# Altium project FlyController-H743-v2.PrjPcb
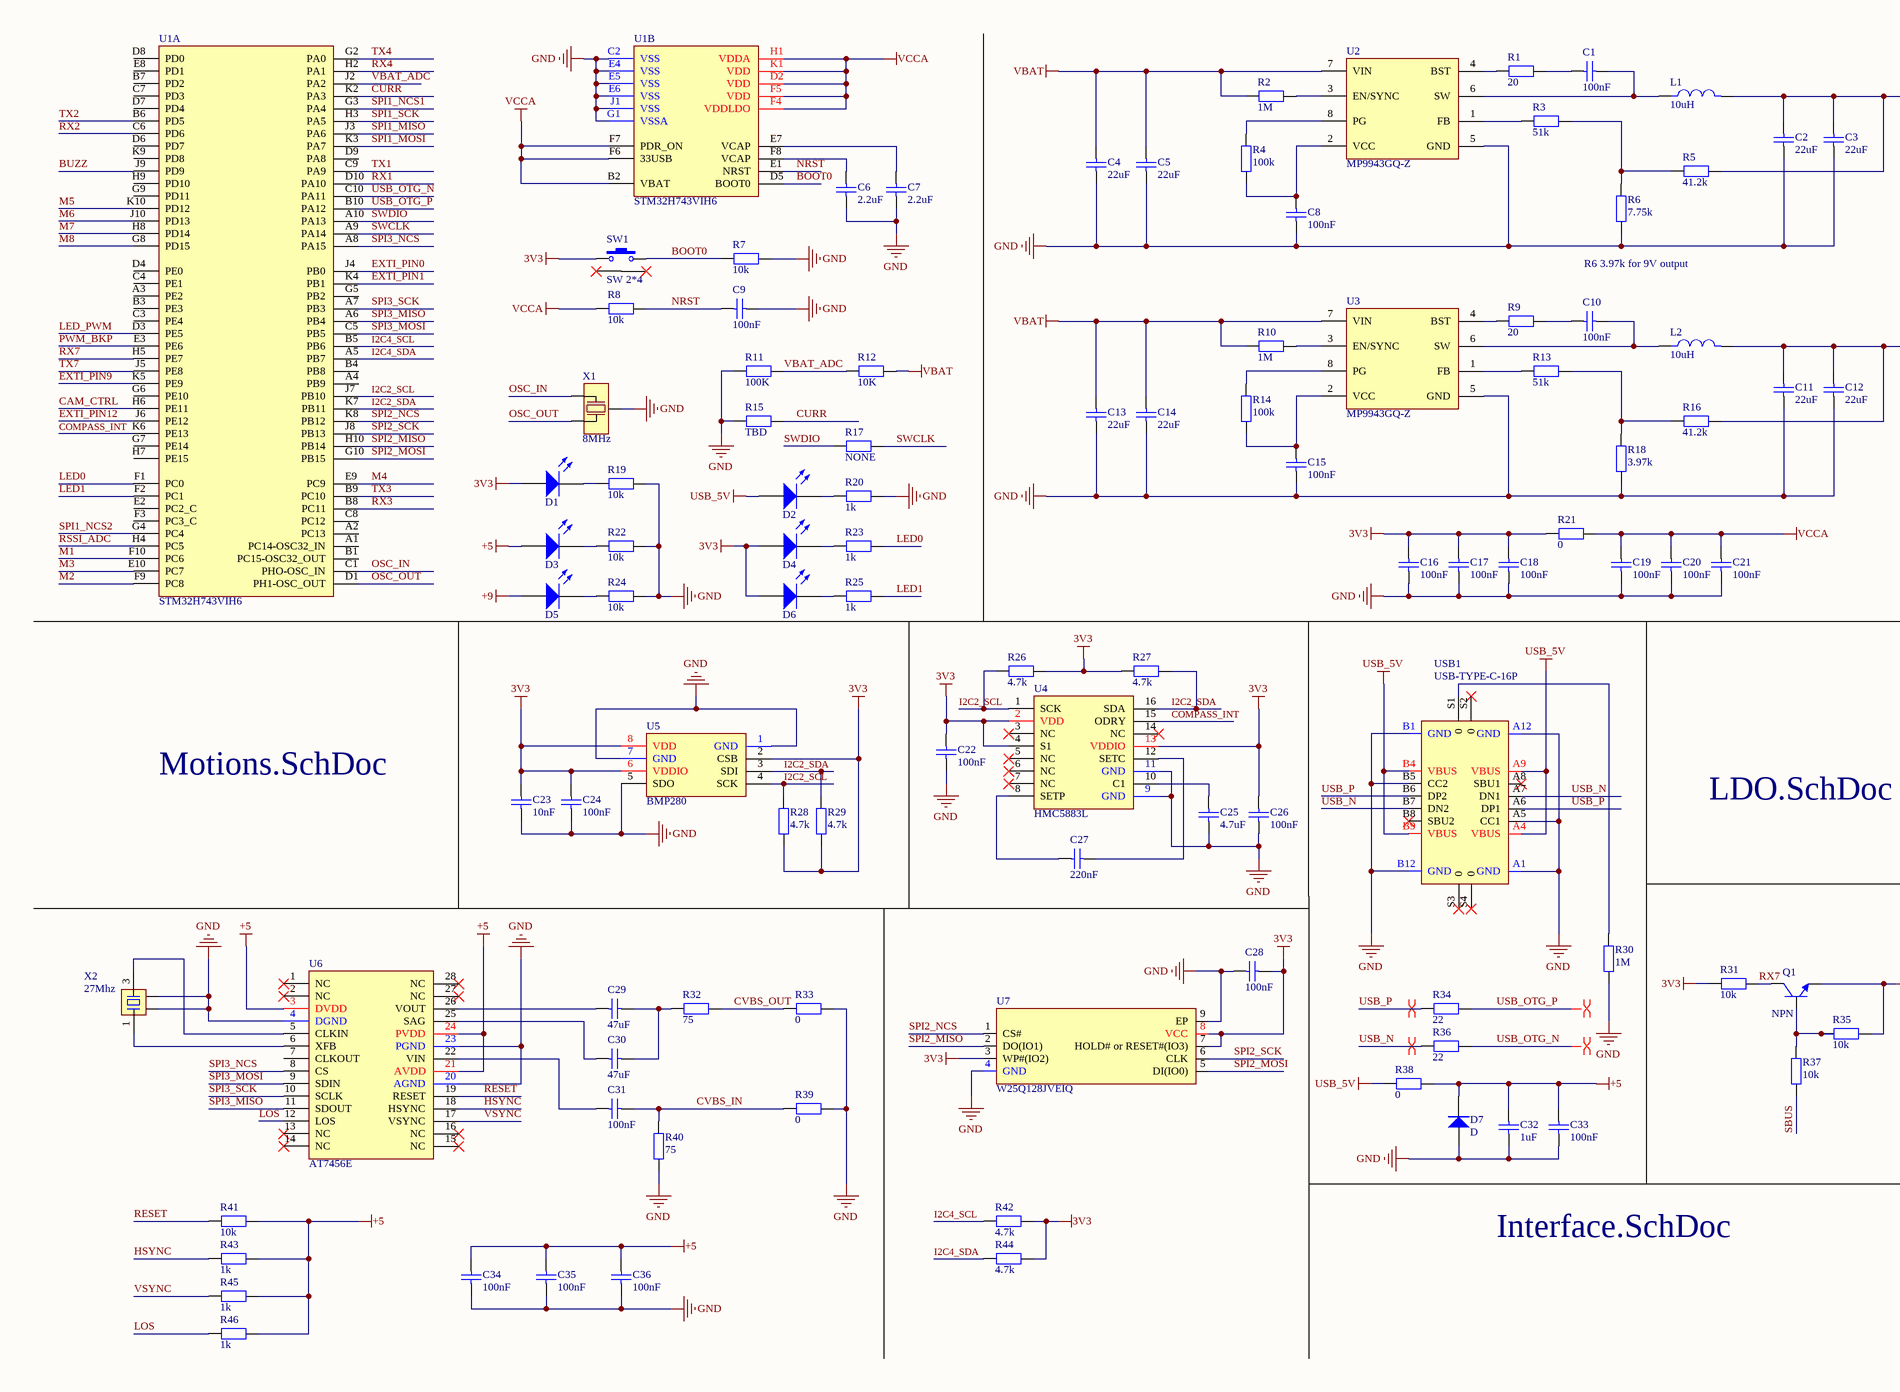
[diagram p0: origin.SchDoc, left]
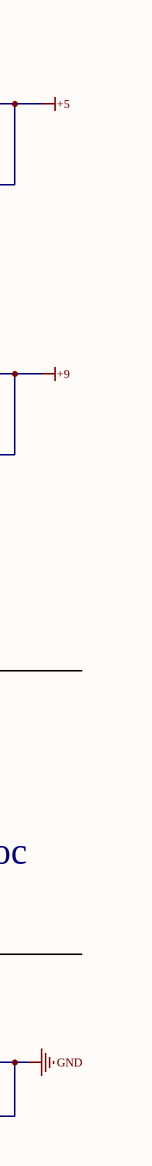
[diagram p1: origin.SchDoc, middle]
4 sheets, 200 parts. Net scope: global (net labels, ports and power ports of the same name join across sheets).
Board file: FlyController-H743-v2.PcbDoc
Sheets:
  origin.SchDoc
  Interface.SchDoc
  Motions.SchDoc
  LDO.SchDoc

## Sheet origin.SchDoc
size 400 x 279 mm; SheetNumber: 1; SheetTotal: 4; SPICEModelCacheTWHSCXQX: <root> / <DocumentId>TWHSCXQX</DocumentId> / </root>

### Parts
C1  100nF  [C0402_NS]
C2  22uF  [C1206_NS]
C3  22uF  [C1206_NS]
C4  22uF  [C1206_NS]
C5  22uF  [C1206_NS]
C6  2.2uF  [C0402_NS]
C7  2.2uF  [C0402_NS]
C8  100nF  [C0402_NS]
C9  100nF  [C0402_NS]
C10  100nF  [C0402_NS]
C11  22uF  [C1206_NS]
C12  22uF  [C1206_NS]
C13  22uF  [C1206_NS]
C14  22uF  [C1206_NS]
C15  100nF  [C0402_NS]
C16  100nF  [C0402_NS]
C17  100nF  [C0402_NS]
C18  100nF  [C0402_NS]
C19  100nF  [C0402_NS]
C20  100nF  [C0402_NS]
C21  100nF  [C0402_NS]
C22  100nF  [C0402_NS]
C23  10nF  [C0402_NS]
C24  100nF  [C0402_NS]
C25  4.7uF  [C0402_NS]
C26  100nF  [C0402_NS]
C27  220nF  [C0402_NS]
C28  100nF  [C0402_NS]
C29  47uF  [C_3528]
C30  47uF  [C_3528]
C31  100nF  [C0805_NS]
C32  1uF  [C0402_NS]
C33  100nF  [C0402_NS]
C34  100nF  [C0402_NS]
C35  100nF  [C0402_NS]
C36  100nF  [C0402_NS]
D1  LED  [LED0402-B]  (value not drawn)
D2  LED  [LED0402-B]  (value not drawn)
D3  LED  [LED0402-B]  (value not drawn)
D4  LED  [LED0402-B]  (value not drawn)
D5  LED  [LED0402-B]  (value not drawn)
D6  LED  [LED0402-B]  (value not drawn)
D7  D  [SOD-123]
L1  10uH  [IHLP2020]
L2  10uH  [IHLP2020]
Q1  NPN  [SOT23-3]
R1  20  [R0402_NS]
R2  1M  [R0402_NS]
R3  51k  [R0402_NS]
R4  100k  [R0402_NS]
R5  41.2k  [R0402_NS]
R6  7.75k  [R0402_NS]
R7  10k  [R0402_NS]
R8  10k  [R0402_NS]
R9  20  [R0402_NS]
R10  1M  [R0402_NS]
R11  100K  [R0402_NS]
R12  10K  [R0402_NS]
R13  51k  [R0402_NS]
R14  100k  [R0402_NS]
R15  TBD  [R0603_NS]
R16  41.2k  [R0402_NS]
R17  NONE  [R0402_NS]
R18  3.97k  [R0402_NS]
R19  10k  [R0402_NS]
R20  1k  [R0402_NS]
R21  0  [R0402_NS]
R22  10k  [R0402_NS]
R23  1k  [R0402_NS]
R24  10k  [R0402_NS]
R25  1k  [R0402_NS]
R26  4.7k  [R0402_NS]
R27  4.7k  [R0402_NS]
R28  4.7k  [R0402_NS]
R29  4.7k  [R0402_NS]
R30  1M  [R0402_NS]
R31  10k  [R0402_NS]
R32  75  [R0402_NS]
R33  0  [R0402_NS]
R34  22  [R0402_NS]
R35  10k  [R0402_NS]
R36  22  [R0402_NS]
R37  10k  [R0402_NS]
R38  0  [R0603_NS]
R39  0  [R0402_NS]
R40  75  [R0402_NS]
R41  10k  [R0402_NS]
R42  4.7k  [R0402_NS]
R43  1k  [R0402_NS]
R44  4.7k  [R0402_NS]
R45  1k  [R0402_NS]
R46  1k  [R0402_NS]
SW1  SW 2*4  [SW2*4]
U1  STM32H743VIH6  [TFBGA100]  (parts A,B of 2)
U2  MP9943GQ-Z  [DFN-8]
U3  MP9943GQ-Z  [DFN-8]
U4  HMC5883L  [LGA-16]
U5  BMP280  [LGA-8-BMP280]
U6  AT7456E  [TSSOP28]
U7  W25Q128JVEIQ  [WSON-8]
USB1  USB-TYPE-C-16P  [USB-C-SMD_16P]
X1  8MHz  [OSC-SMD-3]
X2  27Mhz  [XTAL-2025-4P]

### Nets
3V3: C16.1 C17.1 C18.1 C22.1 C23.1 C24.1 C26.1 C28.2 D1.1(A) D4.1(A) D6.1(A) R21.1 R26.1 R27.2 R28.2 R29.2 R31.2 R42.2 R44.2 SW1.1 U4.2(VDD) U4.4(S1) U4.13(VDDIO) U5.2(CSB) U5.6(VDDIO) U5.8(VDD) U7.3(WP#(IO2)) U7.7(HOLD#_or_RESET#(IO3)) U7.8(VCC)
+5: C2.2 C3.2 C32.1 C33.1 C34.1 C35.1 C36.1 D3.1(A) D7.2(K) L1.2 R5.1 R38.2 R41.2 R43.2 R45.2 R46.2 U6.3(DVDD) U6.21(AVDD) U6.24(PVDD)
+9: C11.2 C12.2 D5.1(A) L2.2 R16.1
GND: C2.1 C3.1 C4.1 C5.1 C6.1 C7.1 C8.1 C9.1 C11.1 C12.1 C13.1 C14.1 C15.1 C16.2 C17.2 C18.2 C19.2 C20.2 C21.2 C22.2 C23.2 C24.2 C25.2 C26.2 C28.1 C32.2 C33.2 C34.2 C35.2 C36.2 D7.1(A) Q1.2(E) R6.2 R7.2 R11.1 R15.1 R18.2 R19.2 R20.2 R22.2 R24.2 R30.2 R33.2 R35.1 R39.1 R40.1 U1.C2(VSS) U1.E4(VSS) U1.E5(VSS) U1.E6(VSS) U1.G1(VSSA) U1.J1(VSS) U2.5(GND) U3.5(GND) U4.9(GND) U4.11(GND) U5.1(GND) U5.5(SDO) U5.7(GND) U6.4(DGND) U6.20(AGND) U6.23(PGND) U7.4(GND) U7.9(EP) USB1.A1(GND) USB1.A5(CC1) USB1.A12(GND) USB1.B1(GND) USB1.B5(CC2) USB1.B12(GND) X1.2(GND) X2.2 X2.4
USB_5V: D2.1(A) R38.1 USB1.A4(VBUS) USB1.A9(VBUS) USB1.B4(VBUS) USB1.B9(VBUS)
VBAT: C4.2 C5.2 C13.2 C14.2 R2.2 R10.2 R12.2 U2.7(VIN) U3.7(VIN)
VCCA: C19.1 C20.1 C21.1 R8.1 R21.2 U1.B2(VBAT) U1.D2(VDD) U1.F4(VDDLDO) U1.F5(VDD) U1.F6(33USB) U1.F7(PDR_ON) U1.H1(VDDA) U1.K1(VDD)
BOOT0: R7.1 SW1.2 U1.D5(BOOT0)
BUZZ: U1.J9(PD9)
CAM_CTRL: U1.H6(PE11)
COMPASS_INT: U1.K6(PE13) U4.15(ODRY)
CURR: R15.2 U1.K2(PA3)
CVBS_IN: C31.2 R39.2 R40.2
CVBS_OUT: R32.2 R33.1
EXTI_PIN0: U1.J4(PB0)
EXTI_PIN1: U1.K4(PB1)
EXTI_PIN9: U1.K5(PE9)
EXTI_PIN12: U1.J6(PE12)
HSYNC: R43.1 U6.18(HSYNC)
I2C2_SCL: R26.2 R28.1 U1.J7(PB10) U4.1(SCK) U5.4(SCK)
I2C2_SDA: R27.1 R29.1 U1.K7(PB11) U4.16(SDA) U5.3(SDI)
I2C4_SCL: R42.1 U1.B5(PB6)
I2C4_SDA: R44.1 U1.A5(PB7)
LED0: R23.2 U1.F1(PC0)
LED1: R25.2 U1.F2(PC1)
LED_PWM: U1.D3(PE5)
LOS: R46.1 U6.12(LOS)
M1: U1.F10(PC6)
M2: U1.F9(PC8)
M3: U1.E10(PC7)
M4: U1.E9(PC9)
M5: U1.K10(PD12)
M6: U1.J10(PD13)
M7: U1.H8(PD14)
M8: U1.G8(PD15)
NRST: C9.2 R8.2 U1.E1(NRST)
OSC_IN: U1.C1(PHO-OSC_IN) X1.1(OSC_IN)
OSC_OUT: U1.D1(PH1-OSC_OUT) X1.3(OSC_OUT)
PWM_BKP: U1.E3(PE6)
RESET: R41.1 U6.19(RESET)
RSSI_ADC: U1.H4(PC5)
RX1: U1.D10(PA10)
RX2: U1.C6(PD6)
RX3: U1.B8(PC11)
RX4: U1.H2(PA1)
RX7: Q1.3(C) R31.1 U1.H5(PE7)
SBUS: R37.2
SPI1_MISO: U1.J3(PA6)
SPI1_MOSI: U1.K3(PA7)
SPI1_NCS1: U1.G3(PA4)
SPI1_NCS2: U1.G4(PC4)
SPI1_SCK: U1.H3(PA5)
SPI2_MISO: U1.H10(PB14) U7.2(DO(IO1))
SPI2_MOSI: U1.G10(PB15) U7.5(DI(IO0))
SPI2_NCS: U1.K8(PB12) U7.1(CS#)
SPI2_SCK: U1.J8(PB13) U7.6(CLK)
SPI3_MISO: U1.A6(PB4) U6.11(SDOUT)
SPI3_MOSI: U1.C5(PB5) U6.9(SDIN)
SPI3_NCS: U1.A8(PA15) U6.8(CS)
SPI3_SCK: U1.A7(PB3) U6.10(SCLK)
SWCLK: R17.1 U1.A9(PA14)
SWDIO: R17.2 U1.A10(PA13)
TX1: U1.C9(PA9)
TX2: U1.B6(PD5)
TX3: U1.B9(PC10)
TX4: U1.G2(PA0)
TX7: U1.J5(PE8)
USB_N: R36.2 USB1.A7(DN1) USB1.B7(DN2)
USB_OTG_N: R36.1 U1.C10(PA11)
USB_OTG_P: R34.1 U1.B10(PA12)
USB_P: R34.2 USB1.A6(DP1) USB1.B6(DP2)
VBAT_ADC: R11.2 R12.1 U1.J2(PA2)
VSYNC: R45.1 U6.17(VSYNC)
NetC1_1: C1.1 L1.1 U2.6(SW)
NetC1_2: C1.2 R1.1
NetC6_2: C6.2 U1.F8(VCAP)
NetC7_2: C7.2 U1.E7(VCAP)
NetC8_2: C8.2 R4.1 U2.2(VCC)
NetC10_1: C10.1 L2.1 U3.6(SW)
NetC10_2: C10.2 R9.1
NetC15_2: C15.2 R14.1 U3.2(VCC)
NetC25_1: C25.1 U4.10(C1)
NetC27_1: C27.1 U4.8(SETP)
NetC27_2: C27.2 U4.12(SETC)
NetC29_1: C29.1 U6.26(VOUT)
NetC29_2: C29.2 C30.2 R32.1
NetC30_1: C30.1 U6.25(SAG)
NetC31_1: C31.1 U6.22(VIN)
NetD1_2: D1.2(K) R19.1
NetD2_2: D2.2(K) R20.1
NetD3_2: D3.2(K) R22.1
NetD4_2: D4.2(K) R23.1
NetD5_2: D5.2(K) R24.1
NetD6_2: D6.2(K) R25.1
NetQ1_1: Q1.1(B) R35.2 R37.1
NetR1_2: R1.2 U2.4(BST)
NetR2_1: R2.1 U2.3(EN/SYNC)
NetR3_1: R3.1 R5.2 R6.1
NetR3_2: R3.2 U2.1(FB)
NetR4_2: R4.2 U2.8(PG)
NetR9_2: R9.2 U3.4(BST)
NetR10_1: R10.1 U3.3(EN/SYNC)
NetR13_1: R13.1 R16.2 R18.1
NetR13_2: R13.2 U3.1(FB)
NetR14_2: R14.2 U3.8(PG)
NetR30_1: R30.1 USB1.S1(0)
NetU6_5: U6.5(CLKIN) X2.3
NetU6_6: U6.6(XFB) X2.1

Not connected (* = marked no-connect by the designer): SW1 3* 4*; U1 A1(PC14-OSC32_IN) A2(PC13) A3(PE2) A4(PB9) B1(PC15-OSC32_OUT) B3(PE3) B4(PB8) B7(PD2) C3(PE4) C4(PE1) C7(PD3) C8(PC12) D4(PE0) D6(PD7) D7(PD4) D8(PD0) D9(PA8) E2(PC2_C) E8(PD1) F3(PC3_C) G5(PB2) G6(PE10) G7(PE14) G9(PD11) H7(PE15) H9(PD10) K9(PD8); U4 3(NC)* 5(NC)* 6(NC)* 7(NC)* 14(NC)*; U6 1(NC)* 2(NC)* 7(CLKOUT) 13(NC)* 14(NC)* 15(NC)* 16(NC)* 27(NC)* 28(NC)*; USB1 A8(SBU1)* B8(SBU2)* S2(0)* S3(0)* S4(0)*

### Layout directives
differential pair: USB_N, USB_OTG_N, USB_OTG_P, USB_P

### Notes on the sheet
- R6 3.97k for 9V output
- Motions.SchDoc
- LDO.SchDoc
- Interface.SchDoc

### Library data of the parts
C1 C6-C10 C15-C28 C32-C36 = C0402: Capacitance 0402
C2-C5 C11-C14 = C1206: Capacitance 1206
C29 C30 = C
C31 = C0805: Capacitance 0805
D1-D6 = LED0402: 发光二极管; 封装库来自淘宝卖家ID：黄晶宝石: 其他店铺购入均为盗版封装库，请立即申请退款，本店现金奖励20~200元
D7 = D: BOM名称: TVS瞬态抑制二极管; 属性: 30V 600W
L1 L2 = L
Q1 = NPN: NPN三极管
R1-R14 R16-R37 R39-R46 = R0402: Resistance 0402
R15 R38 = R0603: Resistance 0603
SW1 = SW 2*4: 2*4 双进轻触开关
U1 = STM32H743VIH6: 480MHz BGA100 MCU
U2 U3 = MP9943GQ-Z: High Efficiency 3A Peak, 36V, Synchronous Step Down Converter With Power Good
U4 = HMC5883L: Compass, Pin-Pin with QMC5883L
U5 = BMP280: BOSCH Barometer
U6 = AT7456E: 中科微电子 Character Overlay Chip
U7 = W25Q128JVEIQ: 16M SPI Flash WSON-8
USB1 = USB-TYPE-C-16P: TYPE-C USB Male Interface DIP
X1 = Crystal 3P 3213: 3213 Crystal
X2 = Crystal 4P: 4脚无源晶振(谐振器）; 联系卖家，免费查找封装: 唯一出售店铺网址https://shop463601444.taobao.com; BOM名称: 4脚无源晶振(谐振器）

## Sheet Interface.SchDoc
size A4; SheetNumber: 2; SheetTotal: 4
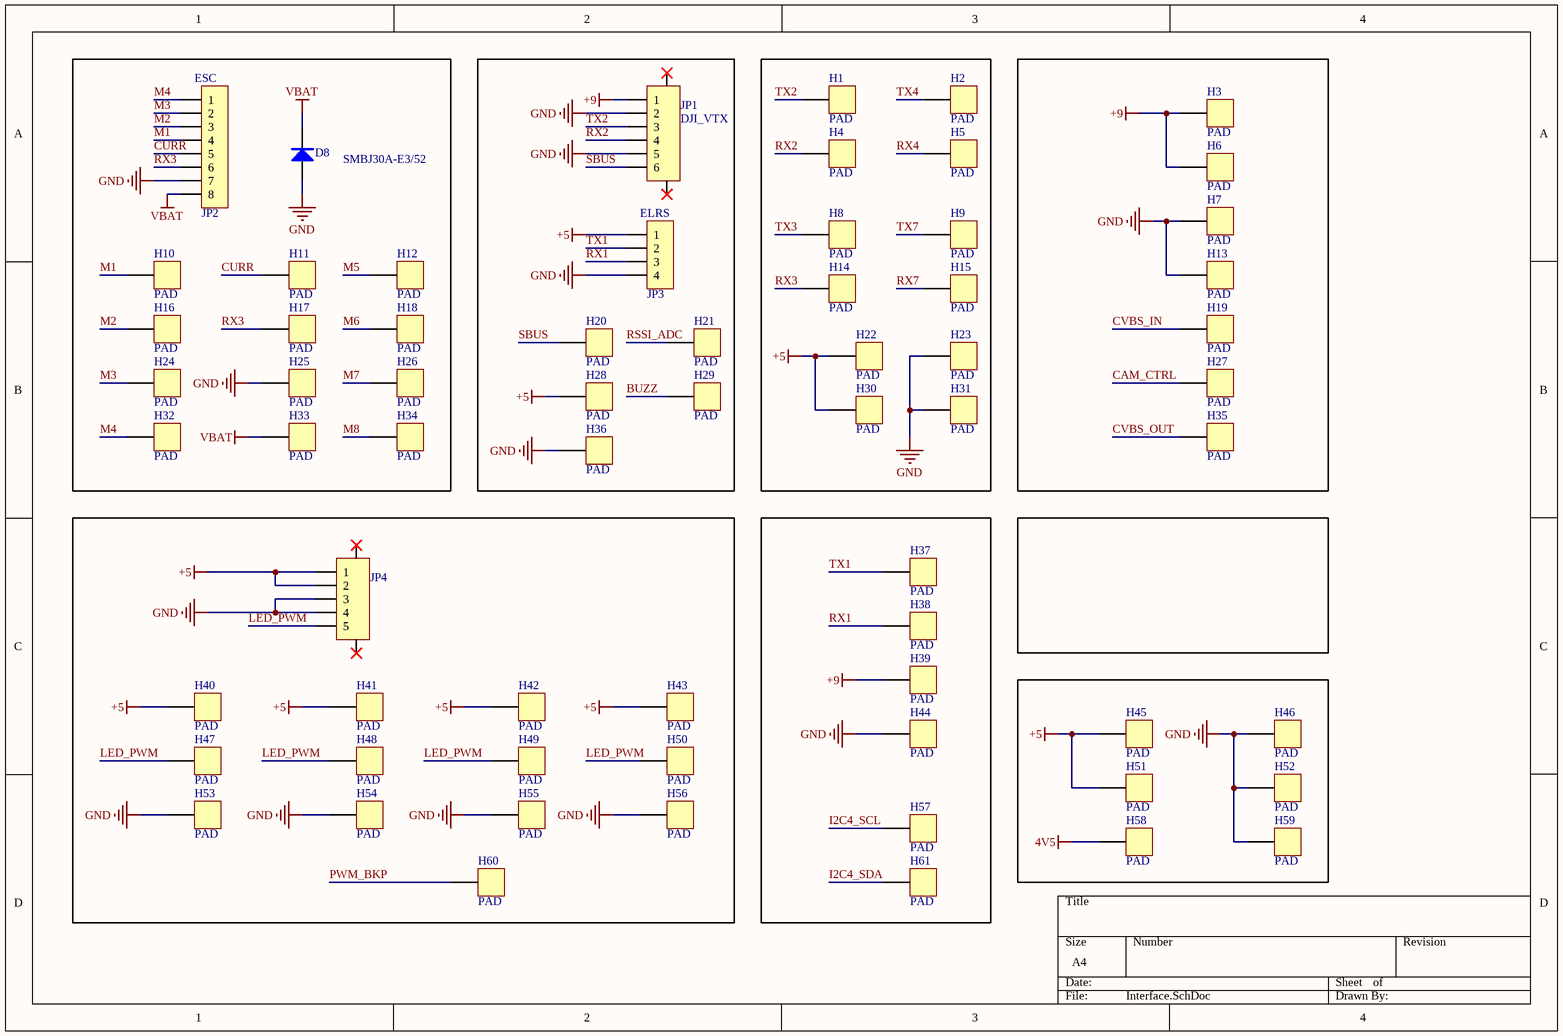
[diagram p2: Interface.SchDoc]

### Parts
D8  SMBJ30A-E3/52  [SMB]
H1  PAD  [Pad 4]
H2  PAD  [Pad 4]
H3  PAD  [Pad 4]
H4  PAD  [Pad 4]
H5  PAD  [Pad 4]
H6  PAD  [Pad 4]
H7  PAD  [Pad 4]
H8  PAD  [Pad 4]
H9  PAD  [Pad 4]
H10  PAD  [Pad 4]
H11  PAD  [Pad 4]
H12  PAD  [Pad 4]
H13  PAD  [Pad 4]
H14  PAD  [Pad 4]
H15  PAD  [Pad 4]
H16  PAD  [Pad 4]
H17  PAD  [Pad 4]
H18  PAD  [Pad 4]
H19  PAD  [Pad 4]
H20  PAD  [Pad 4]
H21  PAD  [Pad 4]
H22  PAD  [Pad 4]
H23  PAD  [Pad 4]
H24  PAD  [Pad 4]
H25  PAD  [Pad 4]
H26  PAD  [Pad 4]
H27  PAD  [Pad 4]
H28  PAD  [Pad 4]
H29  PAD  [Pad 4]
H30  PAD  [Pad 4]
H31  PAD  [Pad 4]
H32  PAD  [Pad 4]
H33  PAD  [Pad 4]
H34  PAD  [Pad 4]
H35  PAD  [Pad 4]
H36  PAD  [Pad 4]
H37  PAD  [Pad 4]
H38  PAD  [Pad 4]
H39  PAD  [Pad 4]
H40  PAD  [Pad 2]
H41  PAD  [Pad 2]
H42  PAD  [Pad 2]
H43  PAD  [Pad 2]
H44  PAD  [Pad 4]
H45  PAD  [Pad 4]
H46  PAD  [Pad 4]
H47  PAD  [Pad 2]
H48  PAD  [Pad 2]
H49  PAD  [Pad 2]
H50  PAD  [Pad 2]
H51  PAD  [Pad 4]
H52  PAD  [Pad 4]
H53  PAD  [Pad 2]
H54  PAD  [Pad 2]
H55  PAD  [Pad 2]
H56  PAD  [Pad 2]
H57  PAD  [Pad 4]
H58  PAD  [Pad 2]
H59  PAD  [Pad 2]
H60  PAD  [Pad 2]
H61  PAD  [Pad 4]
JP1  CON-6P  [SH1.0-WT-6P]  (value not drawn)
JP2  CON-8P  [SH1.0-WT-8P]  (value not drawn)
JP3  CON-4P  [SH1.0-WT-4P]  (value not drawn)
JP4  CON-5P  [SH1.0-WT-5P]  (value not drawn)

### Blocks framed on the sheet
ESC: D8 H10-H12 H16-H18 H24-H26 H32-H34 JP2

### Nets
4V5: H58.1
+5: H22.1 H28.1 H30.1 H40.1 H41.1 H42.1 H43.1 H45.1 H51.1 JP3.1 JP4.1 JP4.2
+9: H3.1 H6.1 H39.1 JP1.1
GND: D8.1(A) H7.1 H13.1 H23.1 H25.1 H31.1 H36.1 H44.1 H46.1 H52.1 H53.1 H54.1 H55.1 H56.1 H59.1 JP1.2 JP1.5 JP2.7 JP3.4 JP4.3 JP4.4
VBAT: D8.2(K) H33.1 JP2.8
BUZZ: H29.1
CAM_CTRL: H27.1
CURR: H11.1 JP2.5
CVBS_IN: H19.1
CVBS_OUT: H35.1
I2C4_SCL: H57.1
I2C4_SDA: H61.1
LED_PWM: H47.1 H48.1 H49.1 H50.1 JP4.5
M1: H10.1 JP2.4
M2: H16.1 JP2.3
M3: H24.1 JP2.2
M4: H32.1 JP2.1
M5: H12.1
M6: H18.1
M7: H26.1
M8: H34.1
PWM_BKP: H60.1
RSSI_ADC: H21.1
RX1: H38.1 JP3.3
RX2: H4.1 JP1.4
RX3: H14.1 H17.1 JP2.6
RX4: H5.1
RX7: H15.1
SBUS: H20.1 JP1.6
TX1: H37.1 JP3.2
TX2: H1.1 JP1.3
TX3: H8.1
TX4: H2.1
TX7: H9.1

Not connected (* = marked no-connect by the designer): JP1 0*; JP4 0*

### Notes on the sheet
- (near JP1) DJI_VTX
- (near JP3) ELRS

### Library data of the parts
D8 = SMBJ30A-E3/52: 30V 600W 瞬态抑制二极管(TVS); BOM名称: TVS瞬态抑制二极管; 属性: 30V 600W
H1-H61 = PAD: Pads
JP1 = Header 6: 6P连接器; BOM名称: 6P连接器
JP2 = Header 8: 8P连接器; BOM名称: 8P连接器
JP3 = Header 4: 4P连接器; BOM名称: 4P连接器
JP4 = Header 5: 5P连接器; BOM名称: 5P连接器

## Sheet Motions.SchDoc
size A4; SheetNumber: 3; SheetTotal: 4
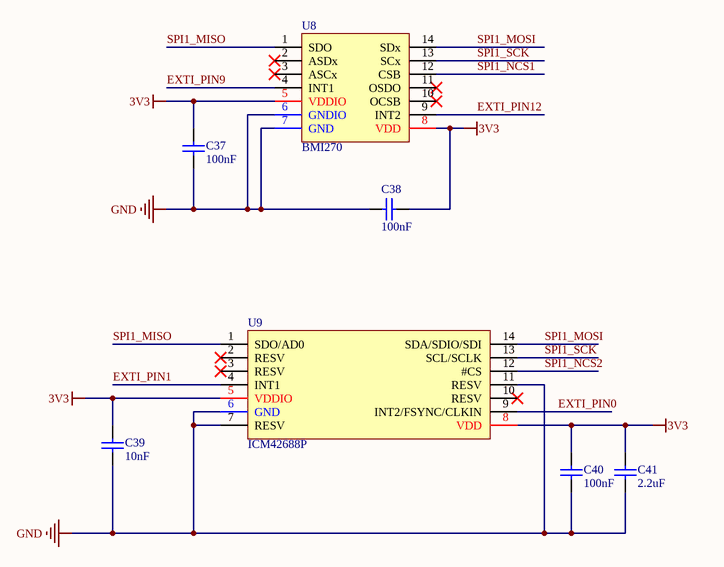
[diagram p3: Motions.SchDoc]

### Parts
C37  100nF  [C0402_NS]
C38  100nF  [C0402_NS]
C39  10nF  [C0402_NS]
C40  100nF  [C0402_NS]
C41  2.2uF  [C0402_NS]
U8  BMI270  [LGA-14]
U9  ICM42688P  [LGA-14]

### Nets
3V3: C37.2 C38.2 C39.2 C40.2 C41.2 U8.5(VDDIO) U8.8(VDD) U9.5(VDDIO) U9.8(VDD)
GND: C37.1 C38.1 C39.1 C40.1 C41.1 U8.6(GNDIO) U8.7(GND) U9.6(GND) U9.7(RESV) U9.11(RESV)
EXTI_PIN0: U9.9(INT2/FSYNC/CLKIN)
EXTI_PIN1: U9.4(INT1)
EXTI_PIN9: U8.4(INT1)
EXTI_PIN12: U8.9(INT2)
SPI1_MISO: U8.1(SDO) U9.1(SDO/AD0)
SPI1_MOSI: U8.14(SDx) U9.14(SDA/SDIO/SDI)
SPI1_NCS1: U8.12(CSB)
SPI1_NCS2: U9.12(#CS)
SPI1_SCK: U8.13(SCx) U9.13(SCL/SCLK)

Not connected (* = marked no-connect by the designer): U8 2(ASDx)* 3(ASCx)* 10(OCSB)* 11(OSDO)*; U9 2(RESV)* 3(RESV)* 10(RESV)*

### Library data of the parts
C37-C41 = C0402: Capacitance 0402
U8 = BMI270: 6-axis, smart, low power Inertial Measurement Unit for high-performance applications
U9 = ICM42688P: TDK Invensense high-performance 6-DOF Motion Tracking MEMS

## Sheet LDO.SchDoc
size A4; SheetNumber: 4; SheetTotal: 4
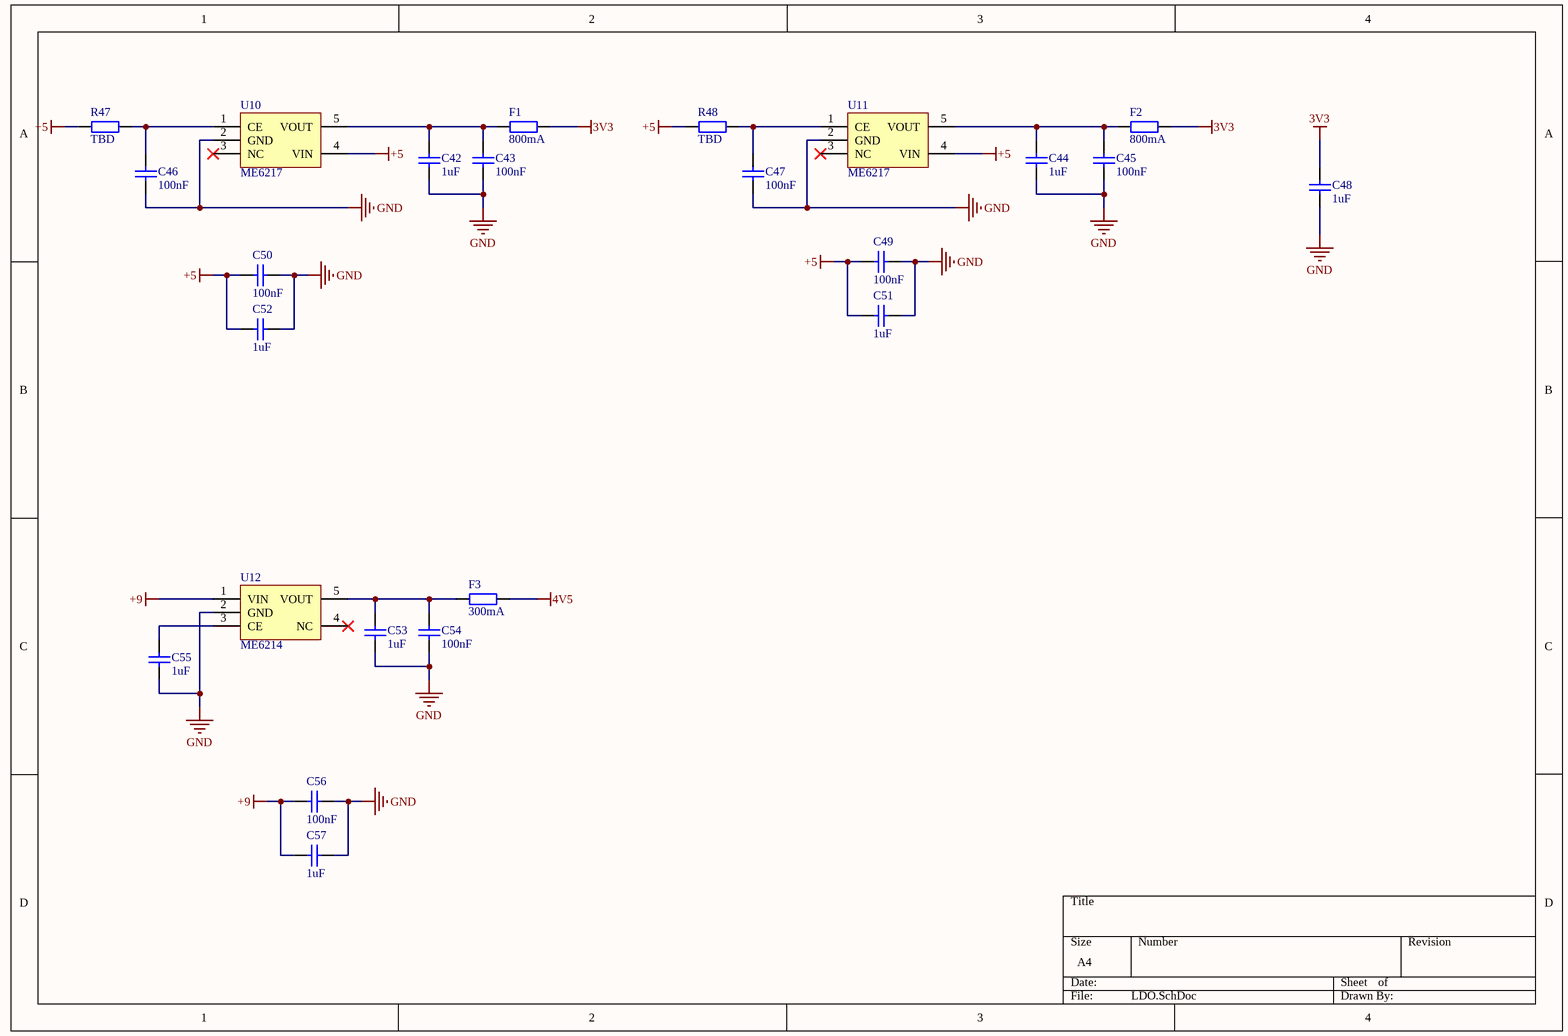
[diagram p4: LDO.SchDoc]

### Parts
C42  1uF  [C0402_NS]
C43  100nF  [C0402_NS]
C44  1uF  [C0402_NS]
C45  100nF  [C0402_NS]
C46  100nF  [C0402_NS]
C47  100nF  [C0402_NS]
C48  1uF  [C3216_NS]
C49  100nF  [C0402_NS]
C50  100nF  [C0402_NS]
C51  1uF  [C0402_NS]
C52  1uF  [C0402_NS]
C53  1uF  [C3216_NS]
C54  100nF  [C0402_NS]
C55  1uF  [C0402_NS]
C56  100nF  [C0402_NS]
C57  1uF  [C0402_NS]
F1  800mA  [R0603_NS]
F2  800mA  [R0603_NS]
F3  300mA  [R0603_NS]
R47  TBD  [R0402_NS]
R48  TBD  [R0402_NS]
U10  ME6217  [SOT23-5]
U11  ME6217  [SOT23-5]
U12  ME6214  [SOT23-5]

### Nets
3V3: C48.2 F1.2 F2.2
4V5: F3.2
+5: C49.2 C50.2 C51.2 C52.2 R47.1 R48.1 U10.4(VIN) U11.4(VIN)
+9: C56.2 C57.2 U12.1(VIN)
GND: C42.2 C43.1 C44.2 C45.1 C46.1 C47.1 C48.1 C49.1 C50.1 C51.1 C52.1 C53.1 C54.1 C55.2 C56.1 C57.1 U10.2(GND) U11.2(GND) U12.2(GND)
NetC42_1: C42.1 C43.2 F1.1 U10.5(VOUT)
NetC44_1: C44.1 C45.2 F2.1 U11.5(VOUT)
NetC46_2: C46.2 R47.2 U10.1(CE)
NetC47_2: C47.2 R48.2 U11.1(CE)
NetC53_2: C53.2 C54.2 F3.1 U12.5(VOUT)
NetC55_1: C55.1 U12.3(CE)

Not connected (* = marked no-connect by the designer): U10 3(NC)*; U11 3(NC)*; U12 4(NC)*

### Library data of the parts
C42-C47 C49-C52 C54-C57 = C0402: Capacitance 0402
C48 C53 = C
F1-F3 = R0603: Resistance 0603
R47 R48 = R0402: Resistance 0402

## Nets that join several sheets
3V3: origin (29 pins), Motions (9 pins), LDO (C48.2 F1.2 F2.2)
4V5: Interface (H58.1), LDO (F3.2)
+5: origin (19 pins), Interface (12 pins), LDO (8 pins)
+9: origin (5 pins), Interface (H3.1 H6.1 H39.1 JP1.1), LDO (C56.2 C57.2 U12.1)
GND: origin (73 pins), Interface (21 pins), Motions (10 pins), LDO (19 pins)
VBAT: origin (9 pins), Interface (D8.2 H33.1 JP2.8)
BUZZ: origin (U1.J9), Interface (H29.1)
CAM_CTRL: origin (U1.H6), Interface (H27.1)
CURR: origin (R15.2 U1.K2), Interface (H11.1 JP2.5)
CVBS_IN: origin (C31.2 R39.2 R40.2), Interface (H19.1)
CVBS_OUT: origin (R32.2 R33.1), Interface (H35.1)
EXTI_PIN0: origin (U1.J4), Motions (U9.9)
EXTI_PIN1: origin (U1.K4), Motions (U9.4)
EXTI_PIN9: origin (U1.K5), Motions (U8.4)
EXTI_PIN12: origin (U1.J6), Motions (U8.9)
I2C4_SCL: origin (R42.1 U1.B5), Interface (H57.1)
I2C4_SDA: origin (R44.1 U1.A5), Interface (H61.1)
LED_PWM: origin (U1.D3), Interface (5 pins)
M1: origin (U1.F10), Interface (H10.1 JP2.4)
M2: origin (U1.F9), Interface (H16.1 JP2.3)
M3: origin (U1.E10), Interface (H24.1 JP2.2)
M4: origin (U1.E9), Interface (H32.1 JP2.1)
M5: origin (U1.K10), Interface (H12.1)
M6: origin (U1.J10), Interface (H18.1)
M7: origin (U1.H8), Interface (H26.1)
M8: origin (U1.G8), Interface (H34.1)
PWM_BKP: origin (U1.E3), Interface (H60.1)
RSSI_ADC: origin (U1.H4), Interface (H21.1)
RX1: origin (U1.D10), Interface (H38.1 JP3.3)
RX2: origin (U1.C6), Interface (H4.1 JP1.4)
RX3: origin (U1.B8), Interface (H14.1 H17.1 JP2.6)
RX4: origin (U1.H2), Interface (H5.1)
RX7: origin (Q1.3 R31.1 U1.H5), Interface (H15.1)
SBUS: origin (R37.2), Interface (H20.1 JP1.6)
SPI1_MISO: origin (U1.J3), Motions (U8.1 U9.1)
SPI1_MOSI: origin (U1.K3), Motions (U8.14 U9.14)
SPI1_NCS1: origin (U1.G3), Motions (U8.12)
SPI1_NCS2: origin (U1.G4), Motions (U9.12)
SPI1_SCK: origin (U1.H3), Motions (U8.13 U9.13)
TX1: origin (U1.C9), Interface (H37.1 JP3.2)
TX2: origin (U1.B6), Interface (H1.1 JP1.3)
TX3: origin (U1.B9), Interface (H8.1)
TX4: origin (U1.G2), Interface (H2.1)
TX7: origin (U1.J5), Interface (H9.1)